# EAGLE design resonator2 (EAGLE 5.07)
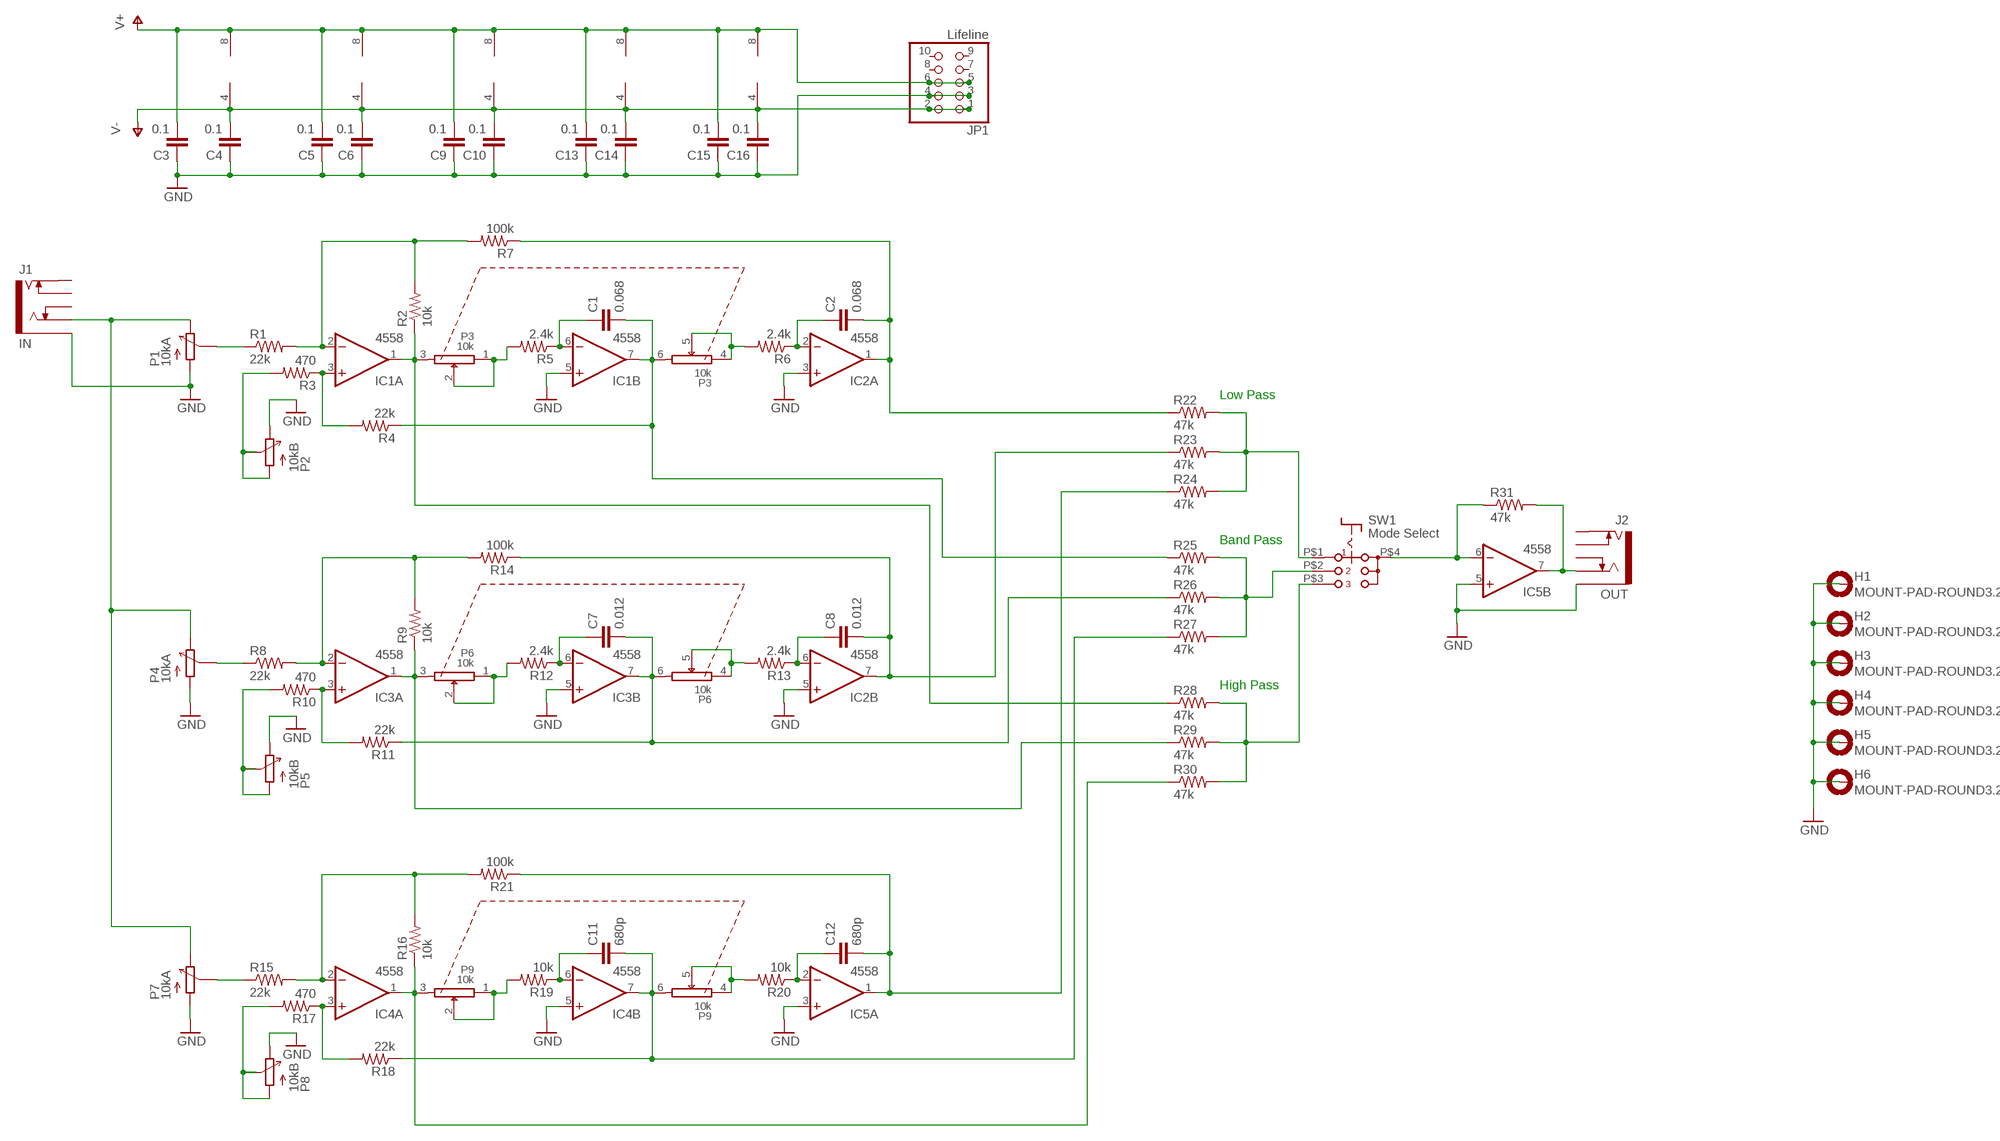
[diagram p0: schematic, sheet 1]

## Parts
C1  0.068  C-EU050-025X075  [C050-025X075]
C2  0.068  C-EU050-025X075  [C050-025X075]
C3  0.1  C-EU050-025X075  [C050-025X075]
C4  0.1  C-EU050-025X075  [C050-025X075]
C5  0.1  C-EU050-025X075  [C050-025X075]
C6  0.1  C-EU050-025X075  [C050-025X075]
C7  0.012  C-EU050-025X075  [C050-025X075]
C8  0.012  C-EU050-025X075  [C050-025X075]
C9  0.1  C-EU050-025X075  [C050-025X075]
C10  0.1  C-EU050-025X075  [C050-025X075]
C11  680p  C-EU050-025X075  [C050-025X075]
C12  680p  C-EU050-025X075  [C050-025X075]
C13  0.1  C-EU050-025X075  [C050-025X075]
C14  0.1  C-EU050-025X075  [C050-025X075]
C15  0.1  C-EU050-025X075  [C050-025X075]
C16  0.1  C-EU050-025X075  [C050-025X075]
H1  MOUNT-PAD-ROUND3.2  [3,2-PAD]
H2  MOUNT-PAD-ROUND3.2  [3,2-PAD]
H3  MOUNT-PAD-ROUND3.2  [3,2-PAD]
H4  MOUNT-PAD-ROUND3.2  [3,2-PAD]
H5  MOUNT-PAD-ROUND3.2  [3,2-PAD]
H6  MOUNT-PAD-ROUND3.2  [3,2-PAD]
IC1  4558  4558L  [SIL08]
IC2  4558  4558L  [SIL08]
IC3  4558  4558L  [SIL08]
IC4  4558  4558L  [SIL08]
IC5  4558  4558L  [SIL08]
J1  IN  MJ-352W-C"  [MJ-352-M-C]
J2  OUT  MJ-352W-C"  [MJ-352-M-C]
JP1  Lifeline  PINHD-2X5  [2X05]
P1  10kA  VR_SLIDE  [VR_SLIDE]
P2  10kB  VR_SLIDE  [VR_SLIDE]
P3  10k  POTL_2SZ  [POTL_2_SUZUSHO]
P4  10kA  VR_SLIDE  [VR_SLIDE]
P5  10kB  VR_SLIDE  [VR_SLIDE]
P6  10k  POTL_2SZ  [POTL_2_SUZUSHO]
P7  10kA  VR_SLIDE  [VR_SLIDE]
P8  10kB  VR_SLIDE  [VR_SLIDE]
P9  10k  POTL_2SZ  [POTL_2_SUZUSHO]
R1  22k  R-US_0204/5_SF  [0204/5_SF]
R2  10k  R-US_0204/5_SF  [0204/5_SF]
R3  470  R-US_0207/7_SF  [0207/7_SMALLFOOT]
R4  22k  R-US_0207/7_SF  [0207/7_SMALLFOOT]
R5  2.4k  R-US_0207/7_SF  [0207/7_SMALLFOOT]
R6  2.4k  R-US_0204/5_SF  [0204/5_SF]
R7  100k  R-US_0207/10_SF  [0207/10SMALLFOOT]
R8  22k  R-US_0207/7_SF  [0207/7_SMALLFOOT]
R9  10k  R-US_0204/5_SF  [0204/5_SF]
R10  470  R-US_0207/7_SF  [0207/7_SMALLFOOT]
R11  22k  R-US_0204/5_SF  [0204/5_SF]
R12  2.4k  R-US_0204/5_SF  [0204/5_SF]
R13  2.4k  R-US_0204/5_SF  [0204/5_SF]
R14  100k  R-US_0204/5_SF  [0204/5_SF]
R15  22k  R-US_0204/5_SF  [0204/5_SF]
R16  10k  R-US_0204/5_SF  [0204/5_SF]
R17  470  R-US_0207/7_SF  [0207/7_SMALLFOOT]
R18  22k  R-US_0207/7_SF  [0207/7_SMALLFOOT]
R19  10k  R-US_0207/7_SF  [0207/7_SMALLFOOT]
R20  10k  R-US_0204/5_SF  [0204/5_SF]
R21  100k  R-US_0207/10_SF  [0207/10SMALLFOOT]
R22  47k  R-US_0207/10_SF  [0207/10SMALLFOOT]
R23  47k  R-US_0207/10_SF  [0207/10SMALLFOOT]
R24  47k  R-US_0207/10_SF  [0207/10SMALLFOOT]
R25  47k  R-US_0207/10_SF  [0207/10SMALLFOOT]
R26  47k  R-US_0207/10_SF  [0207/10SMALLFOOT]
R27  47k  R-US_0207/10_SF  [0207/10SMALLFOOT]
R28  47k  R-US_0207/10_SF  [0207/10SMALLFOOT]
R29  47k  R-US_0207/10_SF  [0207/10SMALLFOOT]
R30  47k  R-US_0207/10_SF  [0207/10SMALLFOOT]
R31  47k  R-US_0204/5_SF  [0204/5_SF]
SW1  Mode Select  ALPS103  [ALPS103]

## Nets
GND: C3.1 C4.1 C5.1 C6.1 C9.1 C10.1 C13.1 C14.1 C15.1 C16.1 H1.B3,2(MOUNT) H2.B3,2(MOUNT) H3.B3,2(MOUNT) H4.B3,2(MOUNT) H5.B3,2(MOUNT) H6.B3,2(MOUNT) IC1.5(B:+IN) IC2.3(A:+IN) IC2.5(B:+IN) IC3.5(B:+IN) IC4.5(B:+IN) IC5.3(A:+IN) IC5.5(B:+IN) J1.P$1 J2.P$1 JP1.3 JP1.4 P1.P$1(A) P2.P$3(E) P4.P$1(A) P5.P$3(E) P7.P$1(A) P8.P$3(E)
N$1: IC1.2(A:-IN) R1.2 R2.2 R7.2
N$2: IC1.3(A:+IN) R3.1 R4.2
N$3: P2.P$1(A) P2.P$2@1(S) P2.P$2@2(S) R3.2
N$4: C2.1 IC2.2(A:-IN) R6.1
N$5: IC1.1(A:OUT) P3.3 R2.1 R28.1
N$6: P1.P$2@2(S) R1.1
N$7: IC3.2(A:-IN) R8.2 R9.2 R14.2
N$8: C1.2 IC1.7(B:OUT) P3.6 R4.1 R25.1
N$9: P3.1 P3.2 R5.2
N$10: P3.4 P3.5 R6.2
N$11: C2.2 IC2.1(A:OUT) R7.1 R22.1
N$13: C1.1 IC1.6(B:-IN) R5.1
N$14: IC3.3(A:+IN) R10.1 R11.2
N$15: C8.1 IC2.6(B:-IN) R13.1
N$16: IC3.1(A:OUT) P6.3 R9.1 R29.1
N$17: C7.2 IC3.7(B:OUT) P6.6 R11.1 R26.1
N$18: P6.1 P6.2 R12.2
N$19: P6.4 P6.5 R13.2
N$20: C8.2 IC2.7(B:OUT) R14.1 R23.1
N$21: P4.P$2@2(S) R8.1
N$22: IC4.2(A:-IN) R15.2 R16.2 R21.2
N$23: C7.1 IC3.6(B:-IN) R12.1
N$24: P5.P$1(A) P5.P$2@1(S) P5.P$2@2(S) R10.2
N$25: IC4.3(A:+IN) R17.1 R18.2
N$26: C12.1 IC5.2(A:-IN) R20.1
N$27: IC4.1(A:OUT) P9.3 R16.1 R30.1
N$28: C11.2 IC4.7(B:OUT) P9.6 R18.1 R27.1
N$29: P9.1 P9.2 R19.2
N$30: P9.4 P9.5 R20.2
N$31: C12.2 IC5.1(A:OUT) R21.1 R24.1
N$32: P7.P$2@2(S) R15.1
N$33: R22.2 R23.2 R24.2 SW1.P$1(A1)
N$34: C11.1 IC4.6(B:-IN) R19.1
N$35: P8.P$1(A) P8.P$2@1(S) P8.P$2@2(S) R17.2
N$36: R25.2 R26.2 R27.2 SW1.P$2(A2)
N$37: R28.2 R29.2 R30.2 SW1.P$3(A3)
N$38: IC5.6(B:-IN) R31.1 SW1.P$4(A)
N$39: J1.P$2 P1.P$3(E) P4.P$3(E) P7.P$3(E)
N$40: IC5.7(B:OUT) J2.P$2 R31.2
V+: C3.2 C5.2 C9.2 C13.2 C15.2 IC1.8(P:V+) IC2.8(P:V+) IC3.8(P:V+) IC4.8(P:V+) IC5.8(P:V+) JP1.5 JP1.6
V-: C4.2 C6.2 C10.2 C14.2 C16.2 IC1.4(P:V-) IC2.4(P:V-) IC3.4(P:V-) IC4.4(P:V-) IC5.4(P:V-) JP1.1 JP1.2
Unconnected: J1.P$3 J1.P$4 J1.P$5 J2.P$3 J2.P$4 J2.P$5 JP1.7 JP1.8 JP1.9 JP1.10 P1.P$2@1(S) P4.P$2@1(S) P7.P$2@1(S)

## Notes on the sheet
- Low Pass
- Band Pass
- High Pass

## Library data of the parts
C1-C16 = akihabara:C-EU: CAPACITOR, European symbol
H1-H6 = holes:MOUNT-PAD-ROUND: MOUNTING PAD, round
IC1-IC5 = linear:*4558: OP AMP
J1 J2 = akihabara:MJ-352W-C: MJ-352W-C Marushin 3.5mm Stereo Jack
JP1 = pinhead:PINHD-2X5: PIN HEADER
P1 P2 P4 P5 P7 P8 = akihabara:VR_SLIDE
P3 P6 P9 = akihabara:POTL_2
R1-R31 = akihabara:R-US_: RESISTOR, American symbol
SW1 = akihabara:ALPS103: Alps rotary switch.

## Board
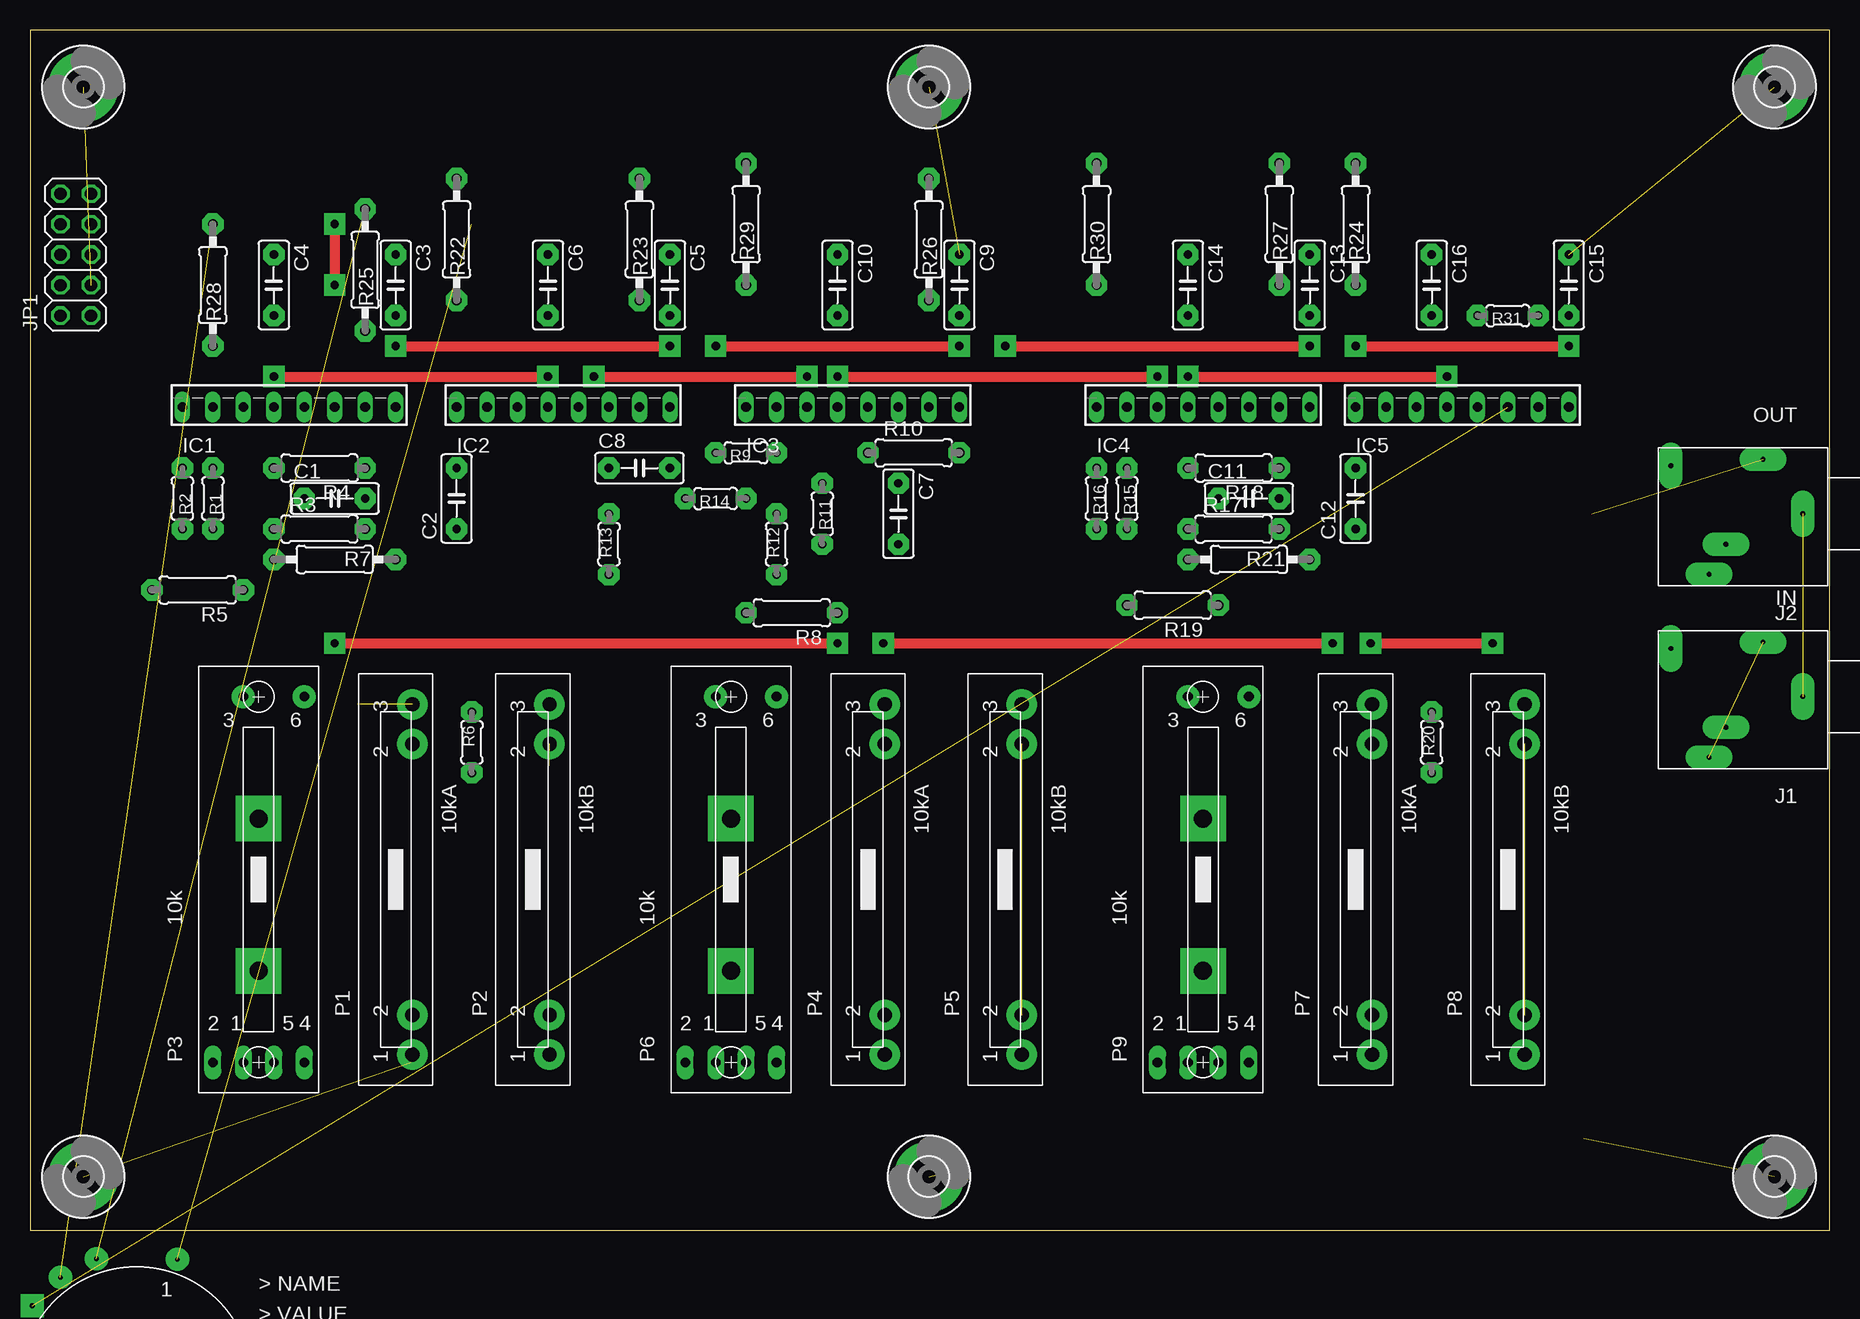
[diagram p1: board, top side]
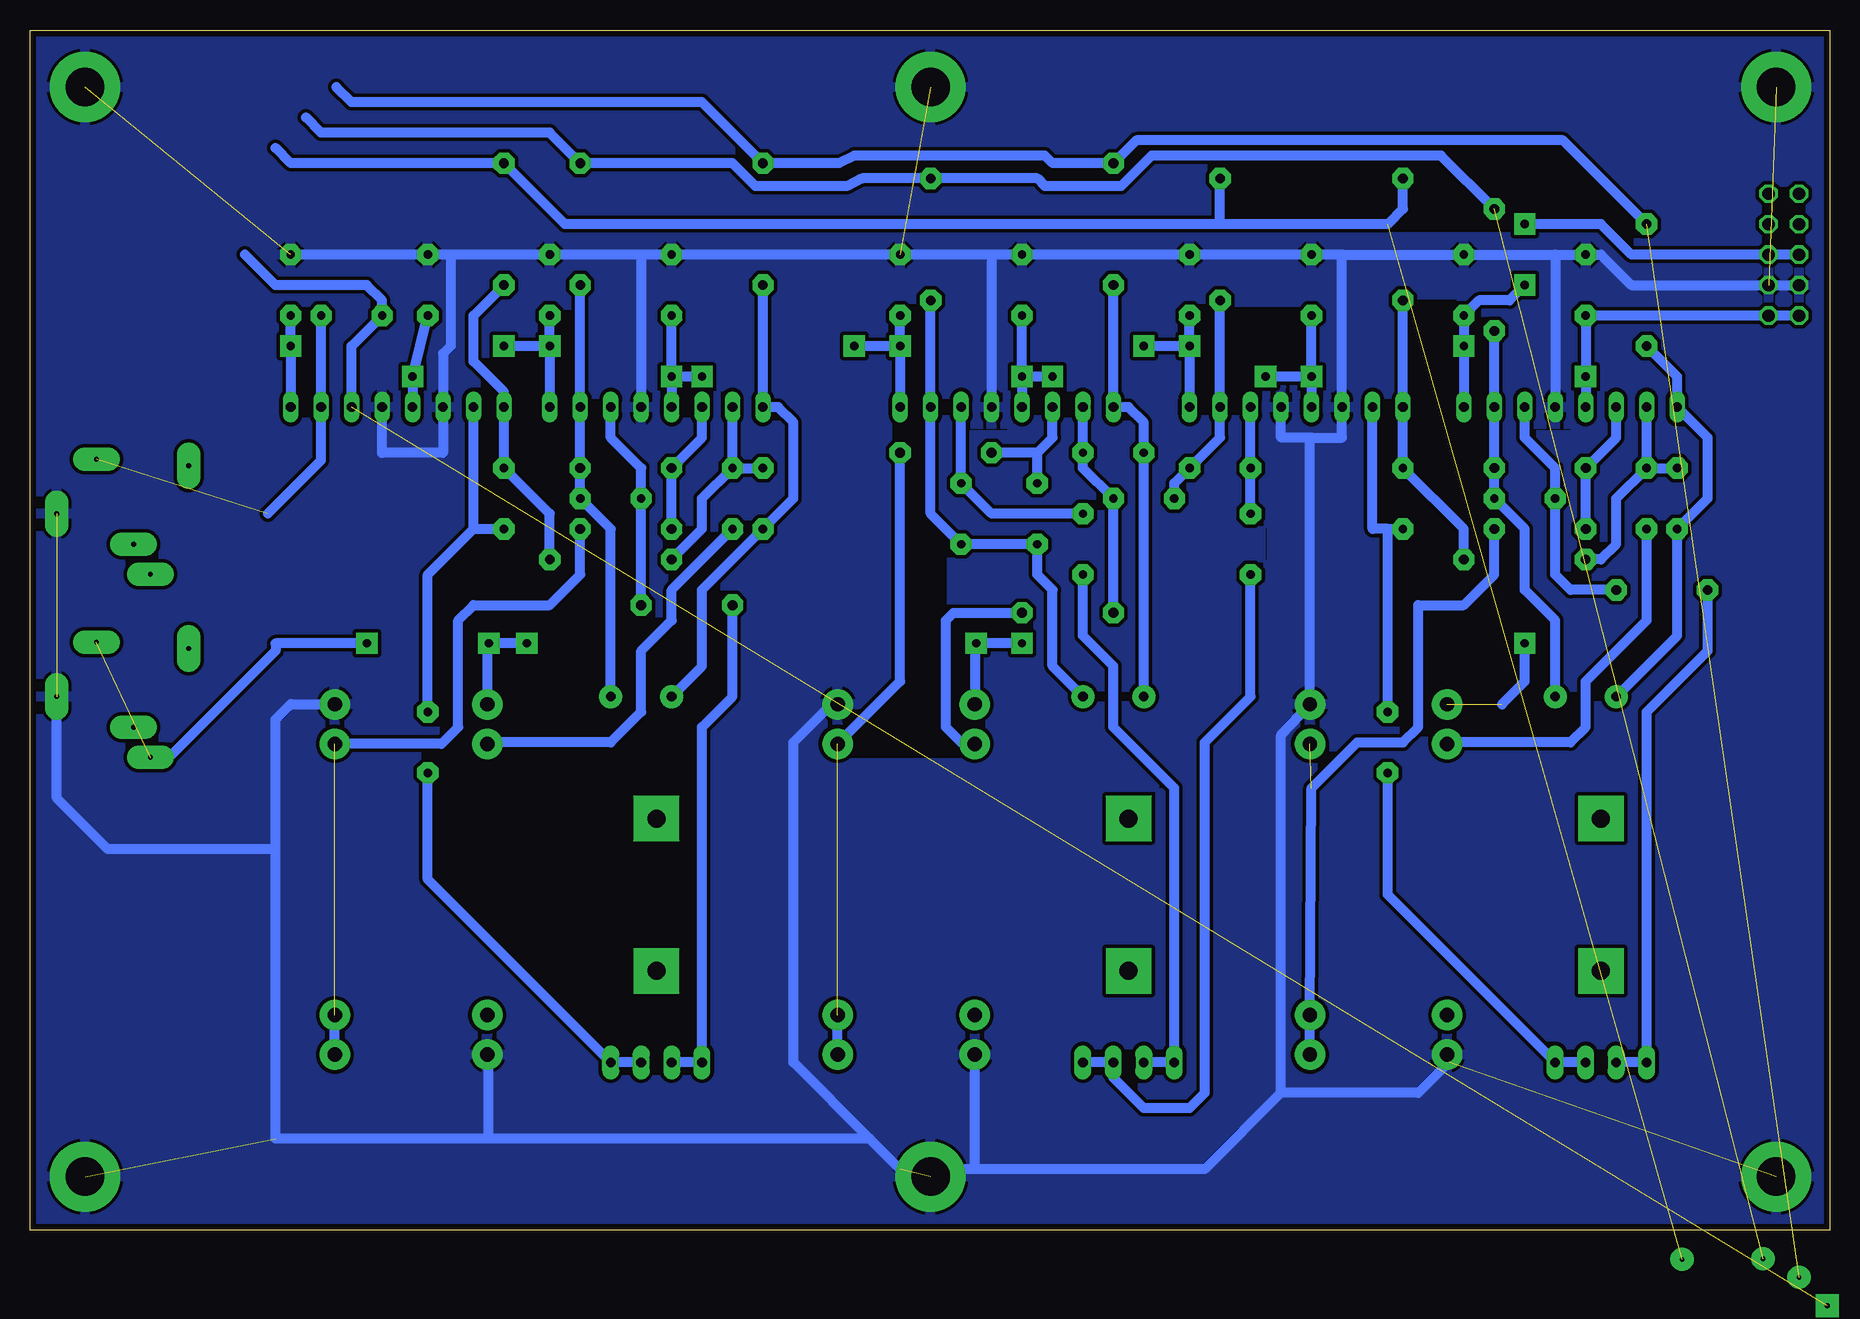
[diagram p2: board, bottom side, seen from below]

Size 150 x 100 mm. Coordinates in mm from the lower left corner, seen from the top.
Outline: 0,0 150,0 150,100 0,100 0,0
Copper layers (1*16): Top 0.035mm / dielectric 1.5mm / Bottom 0.035mm
Design rules "analog20_fine": minimum track width 10mil, minimum drill 10mil, track to track 12mil, track to pad 12mil, pad to pad 12mil, via to via 12mil, smd to smd 12mil, copper to edge 20mil, drill to drill 16mil, minimum pad ring 10mil, minimum via ring 8mil, stop-mask expansion 4mil, vias tented up to drill 0mil, thermal gap 10mil
bRestrict: 13 lines

### Footprints (pad centres in the part's own frame; a part is rotated, then mirrored left to right if it is on the bottom)
C050-025X075 = drill 0.7 pad 1.778 octagon: 1 -2.54,0; 2 2.54,0
3,2-PAD = drill 3.2 pad 5.842 round: B3,2 0,0
SIL08 = drill 0.8 pad 1.27 long: 1 -8.89,0; 2 -6.35,0; 3 -3.81,0; 4 -1.27,0; 5 1.27,0; 6 3.81,0; 7 6.35,0; 8 8.89,0
MJ-352-M-C = drill 0.4 pad 1.95 long: P$1 2.1,0; P$2 5.4,-4.55; P$3 13.1,-4; P$4 8.5,2.55; P$5 9.9,5.05
2X05 = drill 1.016 octagon: 1 -5.08,-1.27; 2 -5.08,1.27; 3 -2.54,-1.27; 4 -2.54,1.27; 5 0,-1.27; 6 0,1.27; 7 2.54,-1.27; 8 2.54,1.27; 9 5.08,-1.27; 10 5.08,1.27
VR_SLIDE = drill 1.2 pad 2.54 round: P$1 -14.6,-1.4; P$2@1 -11.3,-1.4; P$2@2 11.3,-1.4; P$3 14.6,-1.4
POTL_2_SUZUSHO = drill 0.8 pad 1.422 long: 1 -1.27,-15.24; 2 -3.81,-15.24; 4 1.27,-15.24; 5 3.81,-15.24 | drill 0.8 pad 1.93 round: 3 -1.27,15.24; 6 3.81,15.24 | drill 1.5 pad 3.81 square: F@1 0,-7.62; F@2 0,5.08
0204/5_SF = drill 0.7 pad 1.778 octagon: 1 -2.54,0; 2 2.54,0
0207/7_SMALLFOOT = drill 0.813 pad 1.778 octagon: 1 -3.81,0; 2 3.81,0
0207/10SMALLFOOT = drill 0.8 pad 1.778 octagon: 1 -5.08,0; 2 5.08,0
ALPS103 = drill 0.4 pad 1.93 round: P$1 3.4,10.25; P$2 -3.35,10.3; P$3 -6.35,8.75 | drill 0.4 pad 1.93 square: P$4 -8.7,6.4

### Placement (x,y rotation side)
C1  25.4,60.96 0 top
C2  35.56,60.96 90 top
C3  30.48,78.74 270 top
C4  20.32,78.74 270 top
C5  53.34,78.74 270 top
C6  43.18,78.74 270 top
C7  72.39,59.69 270 top
C8  50.8,63.5 0 top
C9  77.47,78.74 270 top
C10  67.31,78.74 270 top
C11  101.6,60.96 0 top
C12  110.49,60.96 90 top
C13  106.68,78.74 270 top
C14  96.52,78.74 270 top
C15  128.27,78.74 270 top
C16  116.84,78.74 270 top
H1  4.45,95.25 0 top
H2  4.45,4.45 0 top
H3  74.93,95.25 0 top
H4  74.93,4.45 0 top
H5  145.41,95.25 0 top
H6  145.41,4.45 0 top
IC1  21.59,68.58 0 top
IC2  44.45,68.58 0 top
IC3  68.58,68.58 0 top
IC4  97.79,68.58 0 top
IC5  119.38,68.58 0 top
J1  149.86,44.45 180 top
J2  149.86,59.69 180 top
JP1  3.81,81.28 90 top
P1  30.48,29.21 90 top
P2  41.91,29.21 90 top
P3  19.05,29.21 0 top
P4  69.85,29.21 90 top
P5  81.28,29.21 90 top
P6  58.42,29.21 0 top
P7  110.49,29.21 90 top
P8  123.19,29.21 90 top
P9  97.79,29.21 0 top
R1  15.24,60.96 90 top
R2  12.7,60.96 90 top
R3  24.13,58.42 0 top
R4  24.13,63.5 180 top
R5  13.97,53.34 180 top
R6  36.83,40.64 270 top
R7  25.4,55.88 180 top
R8  63.5,51.44 180 top
R9  59.69,64.77 0 top
R10  73.66,64.77 0 top
R11  66.04,59.69 90 top
R12  62.23,57.15 270 top
R13  48.26,57.15 270 top
R14  57.15,60.96 0 top
R15  91.44,60.96 90 top
R16  88.9,60.96 90 top
R17  100.33,58.42 0 top
R18  100.33,63.5 180 top
R19  95.25,52.07 180 top
R20  116.84,40.64 270 top
R21  101.6,55.88 180 top
R22  35.56,82.55 90 top
R23  50.8,82.55 90 top
R24  110.49,83.82 90 top
R25  27.94,80.01 90 top
R26  74.93,82.55 90 top
R27  104.14,83.82 90 top
R28  15.24,78.74 90 top
R29  59.69,83.82 90 top
R30  88.9,83.82 90 top
R31  123.19,76.2 0 top
SW1  8.89,-12.7 0 top

### Tracks (layer width: path | path; a pad name or v marks a point on that pad's centre or on a via)
GND  (7 unrouted)
  Bottom 0.813: P1.P$1 31.75,13.97 34.29,11.43 45.72,11.43 | 45.72,11.43 45.72,41.27 P2.P$3 43.31,65.91 43.18,66.04 | 40.64,81.28 IC2.3 40.64,66.04 43.18,66.04 | 40.64,81.28 C6.1 C5.1 C10.1 69.85,81.28 | 40.64,81.28 C3.1 22.86,81.28 | 22.86,81.28 C4.1 19.05,81.28 16.51,78.74 JP1.3 JP1.4 | 22.86,81.28 IC1.5 | 69.85,81.28 IC3.5 | P5.P$3 83.19,43.81 86.36,40.64 86.36,13.97 80.01,7.62 | 80.01,7.62 77.47,5.08 71.12,5.08 | 71.12,5.08 52.07,5.08 45.72,11.43 | P4.P$1 71.25,5.21 71.12,5.08 | 69.85,81.28 C9.1 C14.1 99.06,81.28 | IC2.5 45.72,66.04 43.18,66.04 | P7.P$1 111.76,14.48 111.76,7.62 | 80.01,7.62 111.76,7.62 | P8.P$3 128.27,43.81 129.54,42.55 129.54,31.75 | 129.54,31.75 129.54,7.62 111.76,7.62 | 99.06,81.28 IC4.5 | 99.06,81.28 C13.1 114.94,81.28 | C15.1 C16.1 114.94,81.28 | J1.P$1 147.76,36 143.51,31.75 129.54,31.75 | IC5.5 120.65,64.77 115.57,64.77 IC5.3 115.57,73.03 114.94,73.66 114.94,81.28
  pour Bottom: 0,100.33 151.13,100.33 151.13,0 0,0
N$1
  Bottom 0.813: R1.2 IC1.2 | R1.2 R2.2 | R1.2 17.78,60.96 17.78,57.15 19.05,55.88 R7.2
N$2
  Bottom 0.813: IC1.3 17.78,66.04 R4.2 R3.1
N$3  (1 unrouted)
  Bottom 0.813: P2.P$1 P2.P$2@1 43.18,36.83 39.37,40.64 35.56,40.64 34.29,41.91 34.29,52.07 30.48,52.07 27.94,54.61 R3.2
N$4
  Bottom 0.813: IC2.2 38.1,58.42 36.83,58.42 | 36.83,58.42 C2.1 | R6.1 36.83,58.42
N$5
  Bottom 0.813: P3.3 12.7,49.53 R2.1 10.16,60.96 10.16,66.04 IC1.1 12.7,71.12 R28.1
N$6
  Bottom 0.813: P1.P$2@2 31.62,40.64 21.59,40.64 20.32,41.91 20.32,45.72 15.24,50.8 R1.1
N$7
  Bottom 0.813: IC3.2 R9.2 62.23,63.5 R14.2 R8.2
N$8
  Bottom 0.813: R25.1 IC1.7 R4.1 C1.2 25.4,58.42 25.4,53.34 22.86,50.8 P3.6
N$9
  Bottom 0.813: P3.1 P3.2 15.24,43.18 10.16,48.26 R5.2
N$10
  Bottom 0.813: P3.4 P3.5 36.83,27.94 R6.2
N$11
  Bottom 0.813: R7.1 30.48,58.42 C2.2 IC2.1 R22.1
N$13
  Bottom 0.813: R5.1 21.59,53.34 22.86,54.61 C1.1 22.86,63.5 25.4,66.04 IC1.6
N$14
  Bottom 0.813: R11.2 66.04,64.77 | 66.04,64.77 64.77,66.04 IC3.3 | 66.04,64.77 R10.1
N$15
  Bottom 0.813: IC2.6 C8.1 R13.1
N$16
  Bottom 0.813: P6.3 R9.1 57.15,67.31 58.42,68.58 IC3.1 R29.1
N$17
  Bottom 0.813: P6.6 64.77,46.99 64.77,53.34 66.04,54.61 R11.1 C7.2 74.93,59.69 IC3.7 R26.1
N$18
  Bottom 0.813: P6.1 P6.2 54.61,36.83 59.69,41.91 59.69,46.99 62.23,49.53 R12.2
N$19
  Bottom 0.813: P6.5 P6.4 59.69,12.7 57.15,10.16 53.34,10.16 52.07,11.43 52.07,40.64 48.26,44.45 R13.2
N$20
  Bottom 0.813: R14.1 54.61,62.23 C8.2 50.8,66.04 IC2.7 R23.1
N$21
  Bottom 0.813: R8.1 73.03,51.44 73.66,50.8 73.66,41.91 72.39,40.64 71.38,40.64 P4.P$2@2
N$22
  Bottom 0.813: R15.2 IC4.2 | R15.2 R16.2 | R15.2 93.98,60.96 93.98,58.42 R21.2
N$23
  Bottom 0.813: R12.1 69.85,59.69 C7.1 IC3.6
N$24  (1 unrouted)
  Bottom 0.813: P5.P$1 P5.P$2@1 | R10.2 77.47,45.72 P5.P$2@2
N$25
  Bottom 0.813: IC4.3 93.98,66.04 R18.2 R17.1
N$26
  Bottom 0.813: 113.03,58.42 C12.1 | R20.1 116.84,54.61 113.03,58.42 | 113.03,58.42 IC5.2
N$27
  Bottom 0.813: P9.3 93.98,46.99 93.98,53.34 R16.1 86.36,60.96 86.36,67.31 87.63,68.58 IC4.1 R30.1
N$28
  Bottom 0.813: P9.6 101.6,58.42 C11.2 R18.1 IC4.7 R27.1
N$29
  Bottom 0.813: P9.1 P9.2 93.98,41.91 91.44,44.45 R19.2
N$30
  Bottom 0.813: P9.4 P9.5 116.84,29.21 R20.2
N$31
  Bottom 0.813: R21.1 106.68,59.69 C12.2 IC5.1 110.49,69.85 113.03,72.39 113.03,76.2 R24.1
N$32
  Bottom 0.813: R15.1 96.52,53.34 96.52,50.8 99.06,48.26 99.06,43.18 101.6,40.64 111.76,40.64 P7.P$2@2
N$33  (1 unrouted)
  Bottom 0.813: 129.54,90.17 128.27,88.9 R24.2 105.41,83.82 50.8,83.82 | 50.8,83.82 36.83,83.82 35.56,85.09 R22.2 | 50.8,83.82 R23.2
N$34
  Bottom 0.813: R19.1 C11.1 99.06,63.5 101.6,66.04 IC4.6
N$35  (1 unrouted)
  Bottom 0.813: R17.2 104.14,54.61 106.68,52.07 113.03,52.07 114.3,50.8 114.3,41.91 115.7,40.51 P8.P$2@2 | P8.P$1 P8.P$2@1
N$36  (1 unrouted)
  Bottom 0.813: 127,92.71 125.73,91.44 106.68,91.44 R27.2 91.44,88.9 89.53,87 81.92,87 80.64,87.63 R26.2 66.04,87.63 65.41,87 59.05,87 56.52,89.53 32.38,89.53 R25.2
N$37  (1 unrouted)
  Bottom 0.813: 124.46,95.25 123.19,93.98 93.98,93.98 R30.2 82.55,88.9 81.28,89.53 65.41,89.53 64.77,88.9 R29.2 57.78,90.81 22.23,90.81 R28.2
N$38  (1 unrouted)
  Bottom 0.813: IC5.6 123.19,73.66 R31.1 120.65,77.47 121.92,78.74 129.54,78.74 132.08,81.28
N$39  (via drill 0.7 pad 1.78)  (2 unrouted)
  Top 0.813: v25.4,48.9 v67.31,48.9 | v71.12,48.9 v108.58,48.9 | v111.76,48.9 v121.92,48.9
  Bottom 0.813: 27.31,43.81 25.4,45.72 v25.4,48.9 | 71.12,43.94 P4.P$3 71.25,48.77 v71.12,48.9 v67.31,48.9 | v108.58,48.9 v111.76,48.9 111.89,48.77 P7.P$3 | v121.92,48.9 129.54,48.9 129.54,48.26 138.43,39.37 139.93,39.37
N$40  (1 unrouted)
  Bottom 0.813: 130.18,59.69 125.73,64.14 IC5.7 R31.2
V+  (via drill 0.7 pad 1.78)
  Top 0.813: v30.48,73.66 v53.34,73.66 | v57.15,73.66 v77.47,73.66 | v81.28,73.66 v106.68,73.66 | v110.49,73.66 v128.27,73.66 | v25.4,83.82 v25.4,78.74
  Bottom 0.813: v53.34,73.66 IC2.8 | v106.68,73.66 IC4.8 | IC1.8 v30.48,73.66 C3.2 29.21,77.47 26.67,77.47 v25.4,78.74 | v53.34,73.66 C5.2 | v53.34,73.66 v57.15,73.66 | v77.47,73.66 C9.2 | v77.47,73.66 v81.28,73.66 | v106.68,73.66 C13.2 | v106.68,73.66 v110.49,73.66 | C15.2 v128.27,73.66 IC5.8 | v77.47,73.66 IC3.8 | JP1.6 JP1.5 16.51,81.28 19.05,83.82 v25.4,83.82
V-  (via drill 0.7 pad 1.78)
  Top 0.813: v20.32,71.12 v43.18,71.12 | v46.99,71.12 v64.77,71.12 | v67.31,71.12 v93.98,71.12 | v96.52,71.12 v118.11,71.12
  Bottom 0.813: IC1.4 v20.32,71.12 C4.2 JP1.1 JP1.2 | v43.18,71.12 C6.2 | v43.18,71.12 v46.99,71.12 | v64.77,71.12 v67.31,71.12 | v43.18,71.12 IC2.4 | v93.98,71.12 v96.52,71.12 | v96.52,71.12 IC4.4 | IC5.4 v118.11,71.12 C16.2 | v96.52,71.12 C14.2 | v67.31,71.12 C10.2 | v67.31,71.12 IC3.4